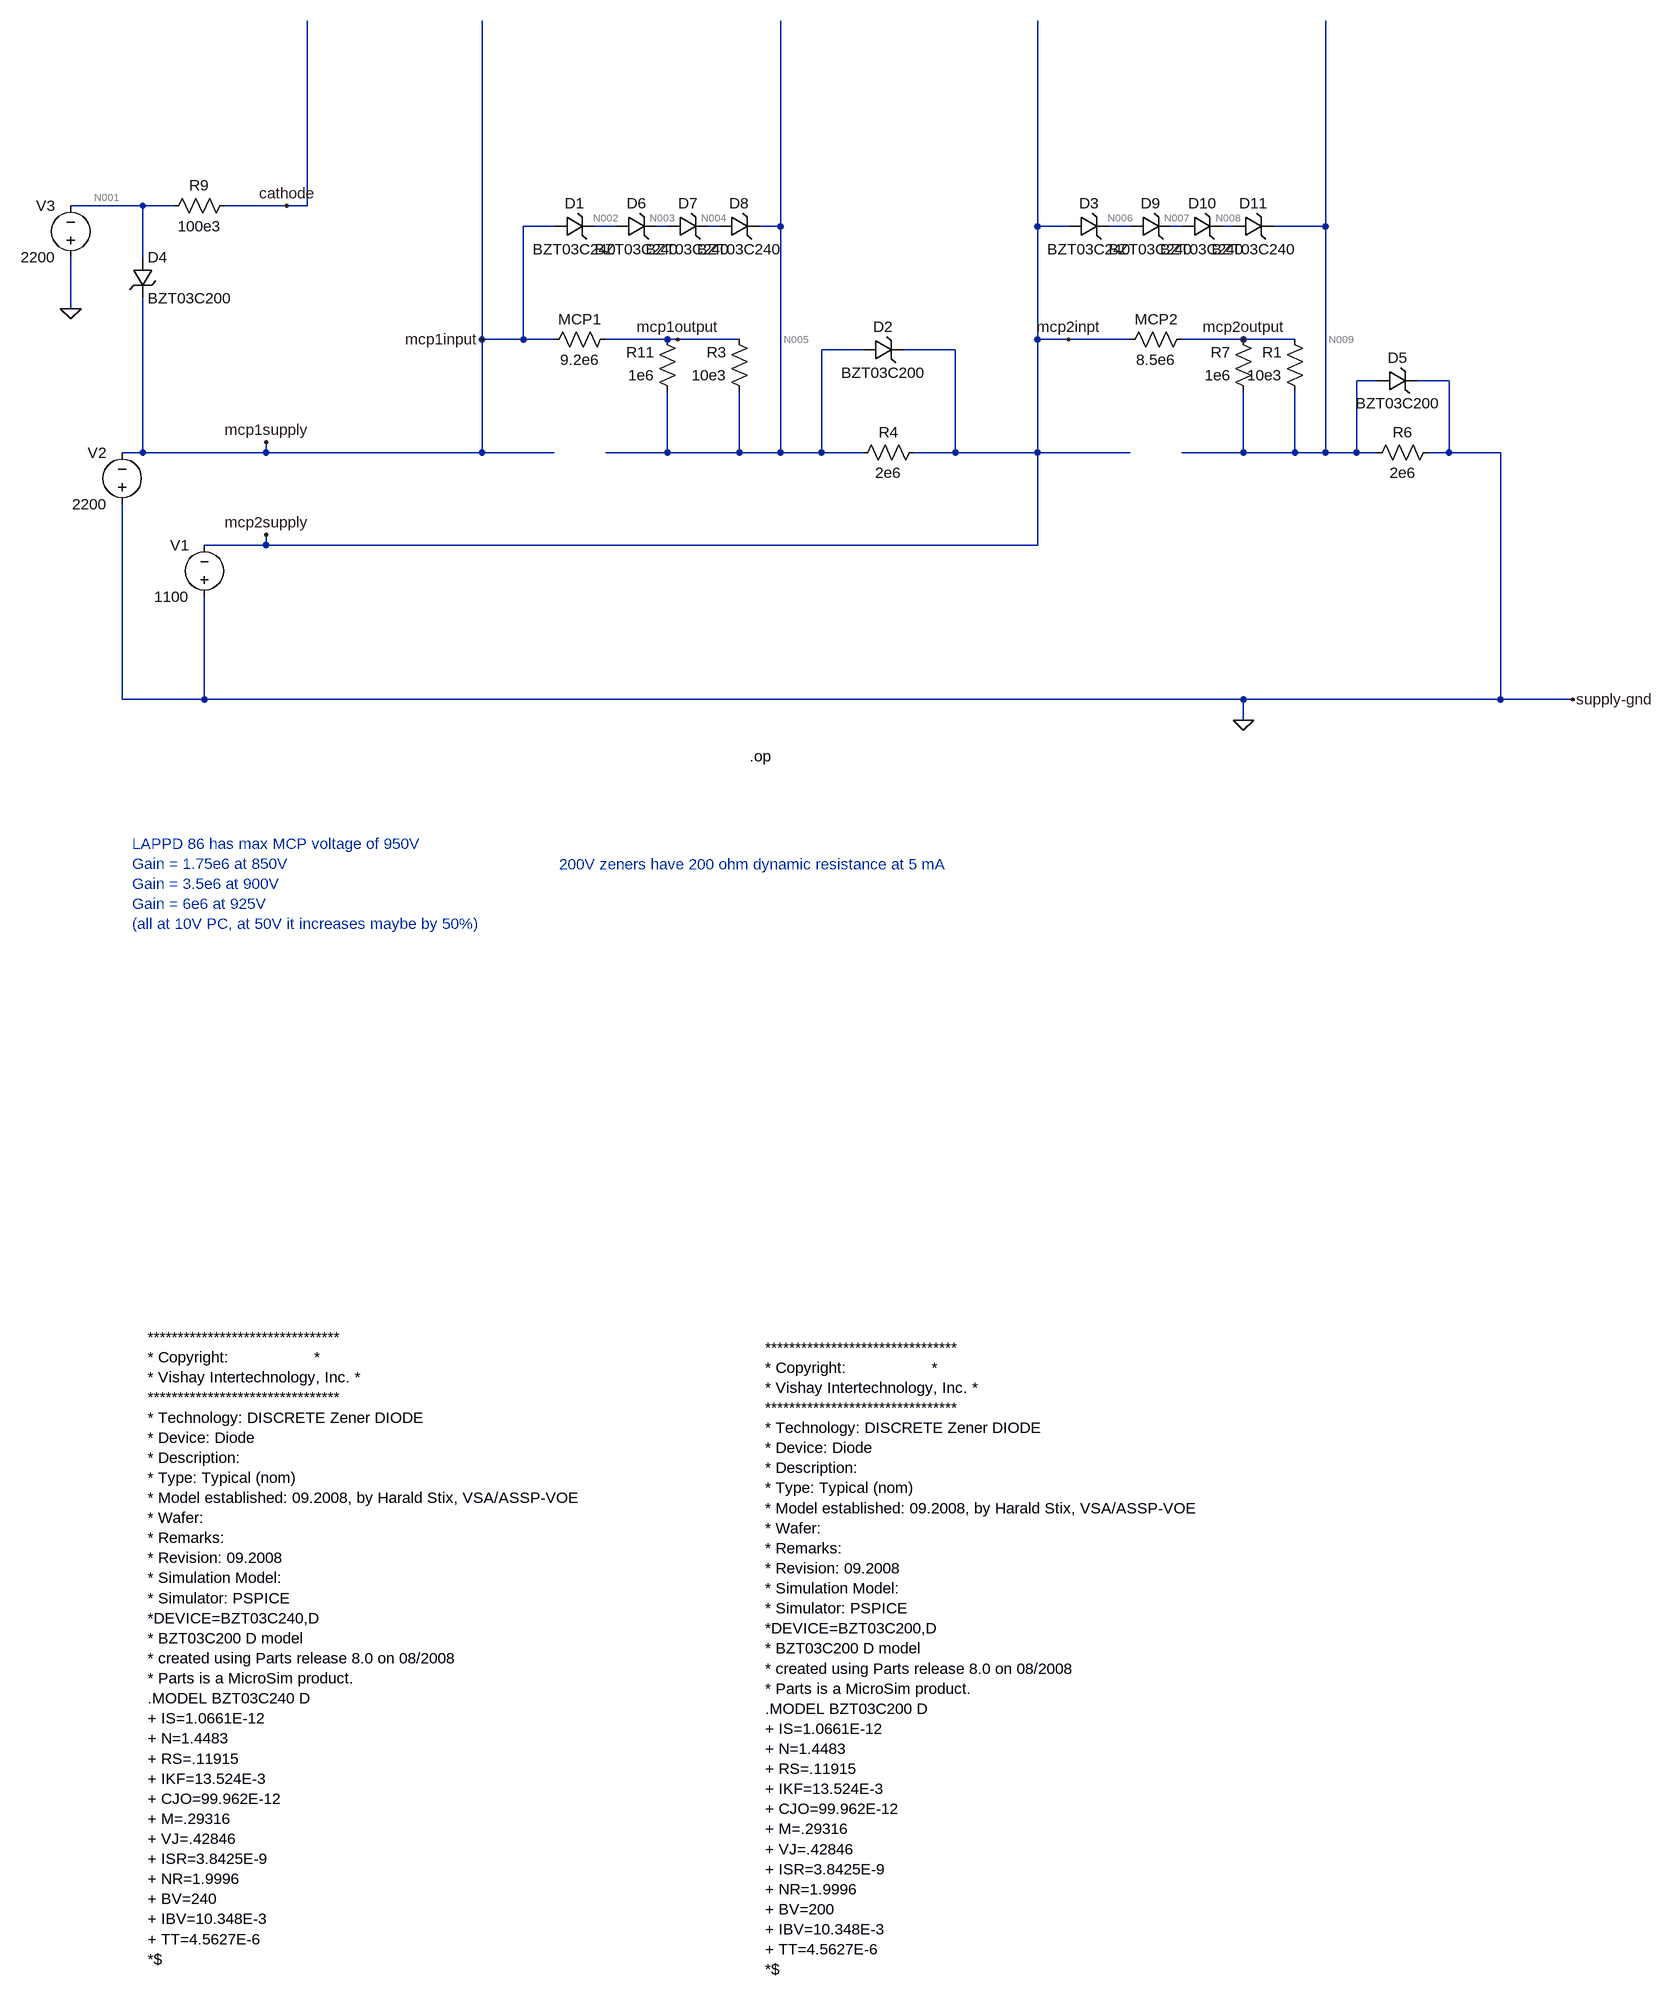
[diagram p0: schematic 86-divider-open.asc]
86-divider-open.asc, the LTspice schematic file:
Version 4
SHEET 1 1988 2392
WIRE -368 -80 -480 -80
WIRE -320 -80 -368 -80
WIRE -144 -80 -240 -80
WIRE -112 -80 -112 -368
WIRE -112 -80 -144 -80
WIRE 272 -48 224 -48
WIRE 368 -48 336 -48
WIRE 448 -48 432 -48
WIRE 528 -48 512 -48
WIRE 624 -48 624 -368
WIRE 624 -48 592 -48
WIRE 1024 -48 1024 -368
WIRE 1072 -48 1024 -48
WIRE 1168 -48 1136 -48
WIRE 1248 -48 1232 -48
WIRE 1328 -48 1312 -48
WIRE 1472 -48 1472 -368
WIRE 1472 -48 1392 -48
WIRE -368 0 -368 -80
WIRE -480 80 -480 0
WIRE 160 128 160 -368
WIRE 224 128 224 -48
WIRE 224 128 160 128
WIRE 272 128 224 128
WIRE 448 128 352 128
WIRE 464 128 448 128
WIRE 560 128 464 128
WIRE 1024 128 1024 -48
WIRE 1072 128 1024 128
WIRE 1168 128 1072 128
WIRE 1344 128 1248 128
WIRE 1424 128 1344 128
WIRE 752 144 688 144
WIRE 896 144 816 144
WIRE 1552 192 1520 192
WIRE 1664 192 1616 192
WIRE -368 304 -368 64
WIRE -368 304 -400 304
WIRE -176 304 -176 288
WIRE -176 304 -368 304
WIRE 160 304 160 128
WIRE 160 304 -176 304
WIRE 272 304 160 304
WIRE 448 304 448 208
WIRE 448 304 352 304
WIRE 560 304 560 208
WIRE 560 304 448 304
WIRE 624 304 624 -48
WIRE 624 304 560 304
WIRE 688 304 688 144
WIRE 688 304 624 304
WIRE 752 304 688 304
WIRE 896 304 896 144
WIRE 896 304 832 304
WIRE 1024 304 1024 128
WIRE 1024 304 896 304
WIRE 1168 304 1024 304
WIRE 1344 304 1344 208
WIRE 1344 304 1248 304
WIRE 1424 304 1424 208
WIRE 1424 304 1344 304
WIRE 1472 304 1472 -48
WIRE 1472 304 1424 304
WIRE 1520 304 1520 192
WIRE 1520 304 1472 304
WIRE 1552 304 1520 304
WIRE 1664 304 1664 192
WIRE 1664 304 1632 304
WIRE 1744 304 1664 304
WIRE -176 448 -176 432
WIRE -176 448 -272 448
WIRE 1024 448 1024 304
WIRE 1024 448 -176 448
WIRE -400 688 -400 384
WIRE -272 688 -272 528
WIRE -272 688 -400 688
WIRE 1344 688 -272 688
WIRE 1744 688 1744 304
WIRE 1744 688 1344 688
WIRE 1856 688 1744 688
WIRE 1344 720 1344 688
FLAG 1856 688 supply-gnd
FLAG 160 128 mcp1input
FLAG 464 128 mcp1output
FLAG 1072 128 mcp2inpt
FLAG 1344 128 mcp2output
FLAG 1344 720 0
FLAG -176 288 mcp1supply
FLAG -176 432 mcp2supply
FLAG -480 80 0
FLAG -144 -80 cathode
DATAFLAG 160 -368 "$"
DATAFLAG -112 -368 "$"
DATAFLAG 624 -368 "$"
DATAFLAG 1024 -368 "$"
DATAFLAG 1472 -368 "$"
SYMBOL res 576 224 R180
WINDOW 0 36 76 Left 2
WINDOW 3 36 40 Left 2
SYMATTR InstName R3
SYMATTR Value 10e3
SYMBOL res 736 320 R270
WINDOW 0 32 56 VTop 2
WINDOW 3 0 56 VBottom 2
SYMATTR InstName R4
SYMATTR Value 2e6
SYMBOL res 1536 320 R270
WINDOW 0 32 56 VTop 2
WINDOW 3 0 56 VBottom 2
SYMATTR InstName R6
SYMATTR Value 2e6
SYMBOL res -224 -96 R90
WINDOW 0 0 56 VBottom 2
WINDOW 3 32 56 VTop 2
SYMATTR InstName R9
SYMATTR Value 100e3
SYMBOL res 256 144 R270
WINDOW 0 32 56 VTop 2
WINDOW 3 0 56 VBottom 2
SYMATTR InstName MCP1
SYMATTR Value 9.2e6
SYMBOL res 1264 112 R90
WINDOW 0 0 56 VBottom 2
WINDOW 3 32 56 VTop 2
SYMATTR InstName MCP2
SYMATTR Value 8.5e6
SYMBOL zener 272 -32 R270
WINDOW 0 36 32 VTop 2
WINDOW 3 -4 32 VBottom 2
SYMATTR InstName D1
SYMATTR Value BZT03C240
SYMBOL voltage -272 544 R180
WINDOW 0 24 96 Left 2
WINDOW 3 24 16 Left 2
SYMATTR InstName V1
SYMATTR Value 1100
SYMBOL zener 752 160 R270
WINDOW 0 36 32 VTop 2
WINDOW 3 -4 32 VBottom 2
SYMATTR InstName D2
SYMATTR Value BZT03C200
SYMBOL voltage -400 400 R180
WINDOW 0 24 96 Left 2
WINDOW 3 24 16 Left 2
SYMATTR InstName V2
SYMATTR Value 2200
SYMBOL voltage -480 16 R180
WINDOW 0 24 96 Left 2
WINDOW 3 24 16 Left 2
SYMATTR InstName V3
SYMATTR Value 2200
SYMBOL zener -384 0 R0
SYMATTR InstName D4
SYMATTR Value BZT03C200
SYMBOL zener 1552 208 R270
WINDOW 0 36 32 VTop 2
WINDOW 3 -4 32 VBottom 2
SYMATTR InstName D5
SYMATTR Value BZT03C200
SYMBOL res 464 224 R180
WINDOW 0 36 76 Left 2
WINDOW 3 36 40 Left 2
SYMATTR InstName R11
SYMATTR Value 1e6
SYMBOL zener 368 -32 R270
WINDOW 0 36 32 VTop 2
WINDOW 3 -4 32 VBottom 2
SYMATTR InstName D6
SYMATTR Value BZT03C240
SYMBOL zener 448 -32 R270
WINDOW 0 36 32 VTop 2
WINDOW 3 -4 32 VBottom 2
SYMATTR InstName D7
SYMATTR Value BZT03C240
SYMBOL zener 528 -32 R270
WINDOW 0 36 32 VTop 2
WINDOW 3 -4 32 VBottom 2
SYMATTR InstName D8
SYMATTR Value BZT03C240
SYMBOL res 1440 224 R180
WINDOW 0 36 76 Left 2
WINDOW 3 36 40 Left 2
SYMATTR InstName R1
SYMATTR Value 10e3
SYMBOL res 1360 224 R180
WINDOW 0 36 76 Left 2
WINDOW 3 36 40 Left 2
SYMATTR InstName R7
SYMATTR Value 1e6
SYMBOL zener 1072 -32 R270
WINDOW 0 36 32 VTop 2
WINDOW 3 -4 32 VBottom 2
SYMATTR InstName D3
SYMATTR Value BZT03C240
SYMBOL zener 1168 -32 R270
WINDOW 0 36 32 VTop 2
WINDOW 3 -4 32 VBottom 2
SYMATTR InstName D9
SYMATTR Value BZT03C240
SYMBOL zener 1248 -32 R270
WINDOW 0 36 32 VTop 2
WINDOW 3 -4 32 VBottom 2
SYMATTR InstName D10
SYMATTR Value BZT03C240
SYMBOL zener 1328 -32 R270
WINDOW 0 36 32 VTop 2
WINDOW 3 -4 32 VBottom 2
SYMATTR InstName D11
SYMATTR Value BZT03C240
TEXT 576 776 Left 2 !.op
TEXT -360 1680 Left 2 !********************************\n* Copyright:                   *\n* Vishay Intertechnology, Inc. *\n********************************\n* Technology: DISCRETE Zener DIODE\n* Device: Diode \n* Description:\n* Type: Typical (nom)\n* Model established: 09.2008, by Harald Stix, VSA/ASSP-VOE\n* Wafer:\n* Remarks:\n* Revision: 09.2008\n* Simulation Model: \n* Simulator: PSPICE\n*DEVICE=BZT03C240,D\n* BZT03C200 D model\n* created using Parts release 8.0 on 08/2008\n* Parts is a MicroSim product.\n.MODEL BZT03C240 D\n+ IS=1.0661E-12\n+ N=1.4483\n+ RS=.11915\n+ IKF=13.524E-3\n+ CJO=99.962E-12\n+ M=.29316\n+ VJ=.42846\n+ ISR=3.8425E-9\n+ NR=1.9996\n+ BV=240\n+ IBV=10.348E-3\n+ TT=4.5627E-6\n*$
TEXT 280 944 Left 2 ;200V zeners have 200 ohm dynamic resistance at 5 mA
TEXT 600 1696 Left 2 !********************************\n* Copyright:                   *\n* Vishay Intertechnology, Inc. *\n********************************\n* Technology: DISCRETE Zener DIODE\n* Device: Diode \n* Description:\n* Type: Typical (nom)\n* Model established: 09.2008, by Harald Stix, VSA/ASSP-VOE\n* Wafer:\n* Remarks:\n* Revision: 09.2008\n* Simulation Model: \n* Simulator: PSPICE\n*DEVICE=BZT03C200,D\n* BZT03C200 D model\n* created using Parts release 8.0 on 08/2008\n* Parts is a MicroSim product.\n.MODEL BZT03C200 D\n+ IS=1.0661E-12\n+ N=1.4483\n+ RS=.11915\n+ IKF=13.524E-3\n+ CJO=99.962E-12\n+ M=.29316\n+ VJ=.42846\n+ ISR=3.8425E-9\n+ NR=1.9996\n+ BV=200\n+ IBV=10.348E-3\n+ TT=4.5627E-6\n*$
TEXT -384 912 Left 2 ;LAPPD 86 has max MCP voltage of 950V \nGain = 1.75e6 at 850V\nGain = 3.5e6 at 900V\nGain = 6e6 at 925V\n(all at 10V PC, at 50V it increases maybe by 50%)

The netlist it stands for:
* 86-divider-open.asc
R3 N005 mcp1output 10e3
R4 N005 mcp2supply 2e6
R6 N009 0 2e6
R9 cathode N001 100e3
R§MCP1 mcp1supply mcp1output 9.2e6
R§MCP2 mcp2output mcp2supply 8.5e6
D1 mcp1supply N002 BZT03C240
V1 0 mcp2supply 1100
D2 N005 mcp2supply BZT03C200
V2 0 mcp1supply 2200
V3 0 N001 2200
D4 N001 mcp1supply BZT03C200
D5 N009 0 BZT03C200
R11 N005 mcp1output 1e6
D6 N002 N003 BZT03C240
D7 N003 N004 BZT03C240
D8 N004 N005 BZT03C240
R1 N009 mcp2output 10e3
R7 N009 mcp2output 1e6
D3 mcp2supply N006 BZT03C240
D9 N006 N007 BZT03C240
D10 N007 N008 BZT03C240
D11 N008 N009 BZT03C240
.model D D
.lib standard.dio
.op
********************************
* Copyright:                   *
* Vishay Intertechnology, Inc. *
********************************
* Technology: DISCRETE Zener DIODE
* Device: Diode
* Description:
* Type: Typical (nom)
* Model established: 09.2008, by Harald Stix, VSA/ASSP-VOE
* Wafer:
* Remarks:
* Revision: 09.2008
* Simulation Model:
* Simulator: PSPICE
*DEVICE=BZT03C240,D
* BZT03C200 D model
* created using Parts release 8.0 on 08/2008
* Parts is a MicroSim product.
.MODEL BZT03C240 D
+ IS=1.0661E-12
+ N=1.4483
+ RS=.11915
+ IKF=13.524E-3
+ CJO=99.962E-12
+ M=.29316
+ VJ=.42846
+ ISR=3.8425E-9
+ NR=1.9996
+ BV=240
+ IBV=10.348E-3
+ TT=4.5627E-6
*$
* 200V zeners have 200 ohm dynamic resistance at 5 mA
********************************
* Copyright:                   *
* Vishay Intertechnology, Inc. *
********************************
* Technology: DISCRETE Zener DIODE
* Device: Diode
* Description:
* Type: Typical (nom)
* Model established: 09.2008, by Harald Stix, VSA/ASSP-VOE
* Wafer:
* Remarks:
* Revision: 09.2008
* Simulation Model:
* Simulator: PSPICE
*DEVICE=BZT03C200,D
* BZT03C200 D model
* created using Parts release 8.0 on 08/2008
* Parts is a MicroSim product.
.MODEL BZT03C200 D
+ IS=1.0661E-12
+ N=1.4483
+ RS=.11915
+ IKF=13.524E-3
+ CJO=99.962E-12
+ M=.29316
+ VJ=.42846
+ ISR=3.8425E-9
+ NR=1.9996
+ BV=200
+ IBV=10.348E-3
+ TT=4.5627E-6
*$
* LAPPD 86 has max MCP voltage of 950V
* Gain = 1.75e6 at 850V
* Gain = 3.5e6 at 900V
* Gain = 6e6 at 925V
* (all at 10V PC, at 50V it increases maybe by 50%)
.backanno
.end

* Results of the author's LTspice run, read from the files saved beside the schematic
* Operating Point:
*   V(n005) = -1.296 kV
*   V(mcp1output) = -1.297 kV
*   V(mcp2supply) = -1.1 kV
*   V(n009) = -199.8 V
*   V(cathode) = -2.2 kV
*   V(n001) = -2.2 kV
*   V(mcp1supply) = -2.2 kV
*   V(mcp2output) = -200.9 V
*   V(n002) = -1.974 kV
*   V(n003) = -1.748 kV
*   V(n004) = -1.522 kV
*   V(n006) = -874.9 V
*   V(n007) = -649.9 V
*   V(n008) = -424.8 V
*   I(D5) = -5.903 µA
*   I(D4) = 0 A
*   I(D2) = -23.37 nA
*   I(D11) = -24.34 nA
*   I(D10) = -24.35 nA
*   I(D9) = -24.35 nA
*   I(D3) = -24.34 nA
*   I(D8) = -24.37 nA
*   I(D7) = -24.37 nA
*   I(D6) = -24.37 nA
*   I(D1) = -24.37 nA
*   I(R7) = 1.047 µA
*   I(R1) = 104.7 µA
*   I(R11) = 971.6 nA
*   I(Mcp2) = 105.8 µA
*   I(Mcp1) = -98.13 µA
*   I(R9) = 0 A
*   I(R6) = -99.9 µA
*   I(R4) = -98.13 µA
*   I(R3) = 97.16 µA
*   I(V3) = -844 fA
*   I(V2) = -98.15 µA
*   I(V1) = -7.654 µA
* From the log:
*   Semiconductor Device Operating Points:
*                           --- Diodes ---
*   Name:      d5          d4          d2          d11         d10
*   Model:  bzt03c200   bzt03c200   bzt03c200   bzt03c240   bzt03c240
*   Id:     -5.90e-06    0.00e+00   -2.34e-08   -2.43e-08   -2.43e-08
*   Vd:     -2.00e+02    0.00e+00   -1.96e+02   -2.25e+02   -2.25e+02
*   Req:     4.37e+03    1.34e+07    2.81e+10    3.09e+10    3.09e+10
*   CAP:     1.06e-09    1.00e-10    1.66e-11    1.59e-11    1.59e-11
*   Name:      d9          d3          d8          d7          d6
*   Model:  bzt03c240   bzt03c240   bzt03c240   bzt03c240   bzt03c240
*   Id:     -2.43e-08   -2.43e-08   -2.44e-08   -2.44e-08   -2.44e-08
*   Vd:     -2.25e+02   -2.25e+02   -2.26e+02   -2.26e+02   -2.26e+02
*   Req:     3.09e+10    3.09e+10    3.10e+10    3.10e+10    3.10e+10
*   CAP:     1.59e-11    1.59e-11    1.59e-11    1.59e-11    1.59e-11
*   Name:      d1
*   Model:  bzt03c240
*   Id:     -2.44e-08
*   Vd:     -2.26e+02
*   Req:     3.10e+10
*   CAP:     1.59e-11
*   Operating Bias Point Solution:
*   V(n005)           -1296.26   voltage
*   V(mcp1output)           -1297.23   voltage
*   V(mcp2supply)              -1100   voltage
*   V(n009)           -199.807   voltage
*   V(cathode)              -2200   voltage
*   V(n001)              -2200   voltage
*   V(mcp1supply)              -2200   voltage
*   V(mcp2output)           -200.854   voltage
*   V(n002)           -1974.07   voltage
*   V(n003)           -1748.13   voltage
*   V(n004)           -1522.19   voltage
*   V(n006)           -874.938   voltage
*   V(n007)           -649.878   voltage
*   V(n008)           -424.843   voltage
*   I(D5)       -5.90277e-06   device_current
*   I(D4)                  0   device_current
*   I(D2)        -2.3369e-08   device_current
*   I(D11)       -2.43446e-08   device_current
*   I(D10)       -2.43451e-08   device_current
*   I(D9)        -2.4347e-08   device_current
*   I(D3)       -2.43442e-08   device_current
*   I(D8)       -2.43747e-08   device_current
*   I(D7)       -2.43728e-08   device_current
*   I(D6)       -2.43728e-08   device_current
*   I(D1)       -2.43728e-08   device_current
*   I(R7)        1.04735e-06   device_current
*   I(R1)        0.000104735   device_current
*   I(R11)        9.71558e-07   device_current
*   I(Mcp2)        0.000105782   device_current
*   I(Mcp1)       -9.81274e-05   device_current
*   I(R9)                  0   device_current
*   I(R6)       -9.99034e-05   device_current
*   I(R4)       -9.81284e-05   device_current
*   I(R3)        9.71558e-05   device_current
*   I(V3)       -8.44009e-13   device_current
*   I(V2)       -9.81517e-05   device_current
*   I(V1)       -7.65447e-06   device_current